# Altium schematic sheet PCB-ButtonBoard.SchDoc
size A4; SheetNumber: 14; SheetTotal: 15
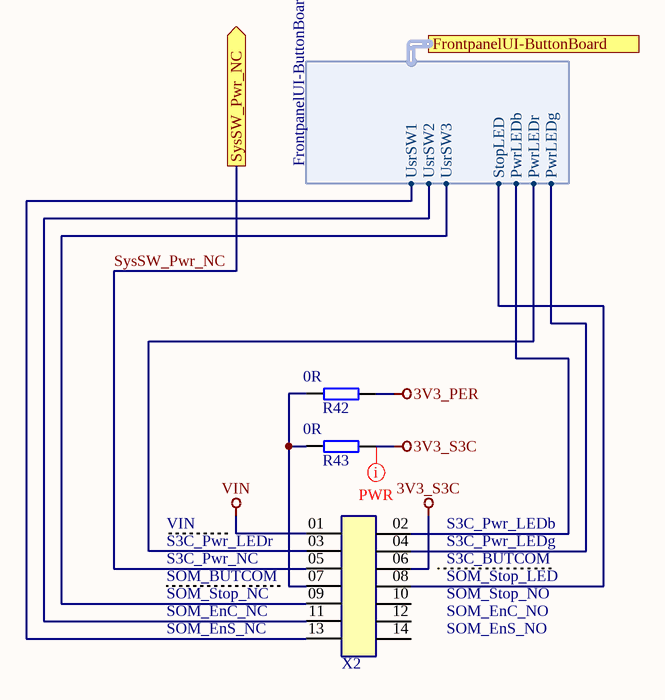
[diagram p0: PCB-ButtonBoard.SchDoc]

## Parts
R42  0R  [R_0603_TE]
R43  0R  [R_0603_TE]
X2  (no value)  [RHDRRA14W79P254_2X7_1829X851X495P]

## Ports
FrontpanelUI-ButtonBoard (harness FrontpanelUI-ButtonBoard), SysSW_Pwr_NC (out)

## Harnesses
FrontpanelUI-ButtonBoard: UsrSW1, UsrSW2, UsrSW3, StopLED, PwrLEDb, PwrLEDr, PwrLEDg

## Nets
3V3_PER: R42.2
3V3_S3C: R43.2 X2.06
VIN: X2.01
SysSW_Pwr_NC: X2.05 ; port SysSW_Pwr_NC
NetR42_1: R42.1 R43.1 X2.07
NetX2_02: X2.02 ; port FrontpanelUI-ButtonBoard.PwrLEDb
NetX2_03: X2.03 ; port FrontpanelUI-ButtonBoard.PwrLEDr
NetX2_04: X2.04 ; port FrontpanelUI-ButtonBoard.PwrLEDg
NetX2_08: X2.08 ; port FrontpanelUI-ButtonBoard.StopLED
NetX2_09: X2.09 ; port FrontpanelUI-ButtonBoard.UsrSW3
NetX2_11: X2.11 ; port FrontpanelUI-ButtonBoard.UsrSW2
NetX2_13: X2.13 ; port FrontpanelUI-ButtonBoard.UsrSW1

Not connected (* = marked no-connect by the designer): X2 10 12 14

## Layout directives
net class PWR: 3V3_S3C

## Notes on the sheet
- S3C_Pwr_LEDr
- S3C_Pwr_NC
- SOM_BUTCOM
- VIN
- S3C_Pwr_LEDb
- S3C_Pwr_LEDg
- S3C_BUTCOM
- SOM_Stop_LED
- SOM_Stop_NC
- SOM_EnC_NC
- SOM_EnS_NC
- SOM_Stop_NO
- SOM_EnC_NO
- SOM_EnS_NO
- Title
- Revision:
- Design Engineer:
- Date:
- Project:
- Sheet
- of

## Library data of the parts
R42 R43 = UZgen_R_0603_0R: Generic resistor; Manufacturer: UZgen; Tolerance: 1 %; Created from: UZgenTool; Manufacturer Part Number: UZgen_R_0603_0R; PartID: 581; Created On: 08/07/2024 14:34:30; Value: 0R; Device Package: 0603; Mounting Type: SMD; Last Updated: 08/07/2024 14:34:30
X2 = PM254-2-07-W-8.5: [low-cost SSW-107-22-F-D-RA] Headers & Wire Housings Tiger Buy Socket Strip with PCB Tails, .100" Pitch; Manufacturer: HCTL; Created from: FRosner/MGeier; Manufacturer Part Number: PM254-2-07-W-8.5; PartID: 43; Created On: 03.07.2024 09:52:49; ComponentLink1Description: Datasheet; ComponentLink1URL: https://wmsc.lcsc.com/wmsc/upload/file/pdf/v2/lcsc/2306091006_HCTL-PM254-2-07-W-8-5_C2897427.pdf; Last Updated: 17.08.2024 14:55:01; Mounting Type: THT; Operating Temperature: -40℃~+105℃; Supplier 1: LCSC; Supplier Part Number 1: C2897427; Value: PM254-2-07-W-8.5; LCSC Part Number: C2897427